# Altium project cameraFor4G.PrjPCB
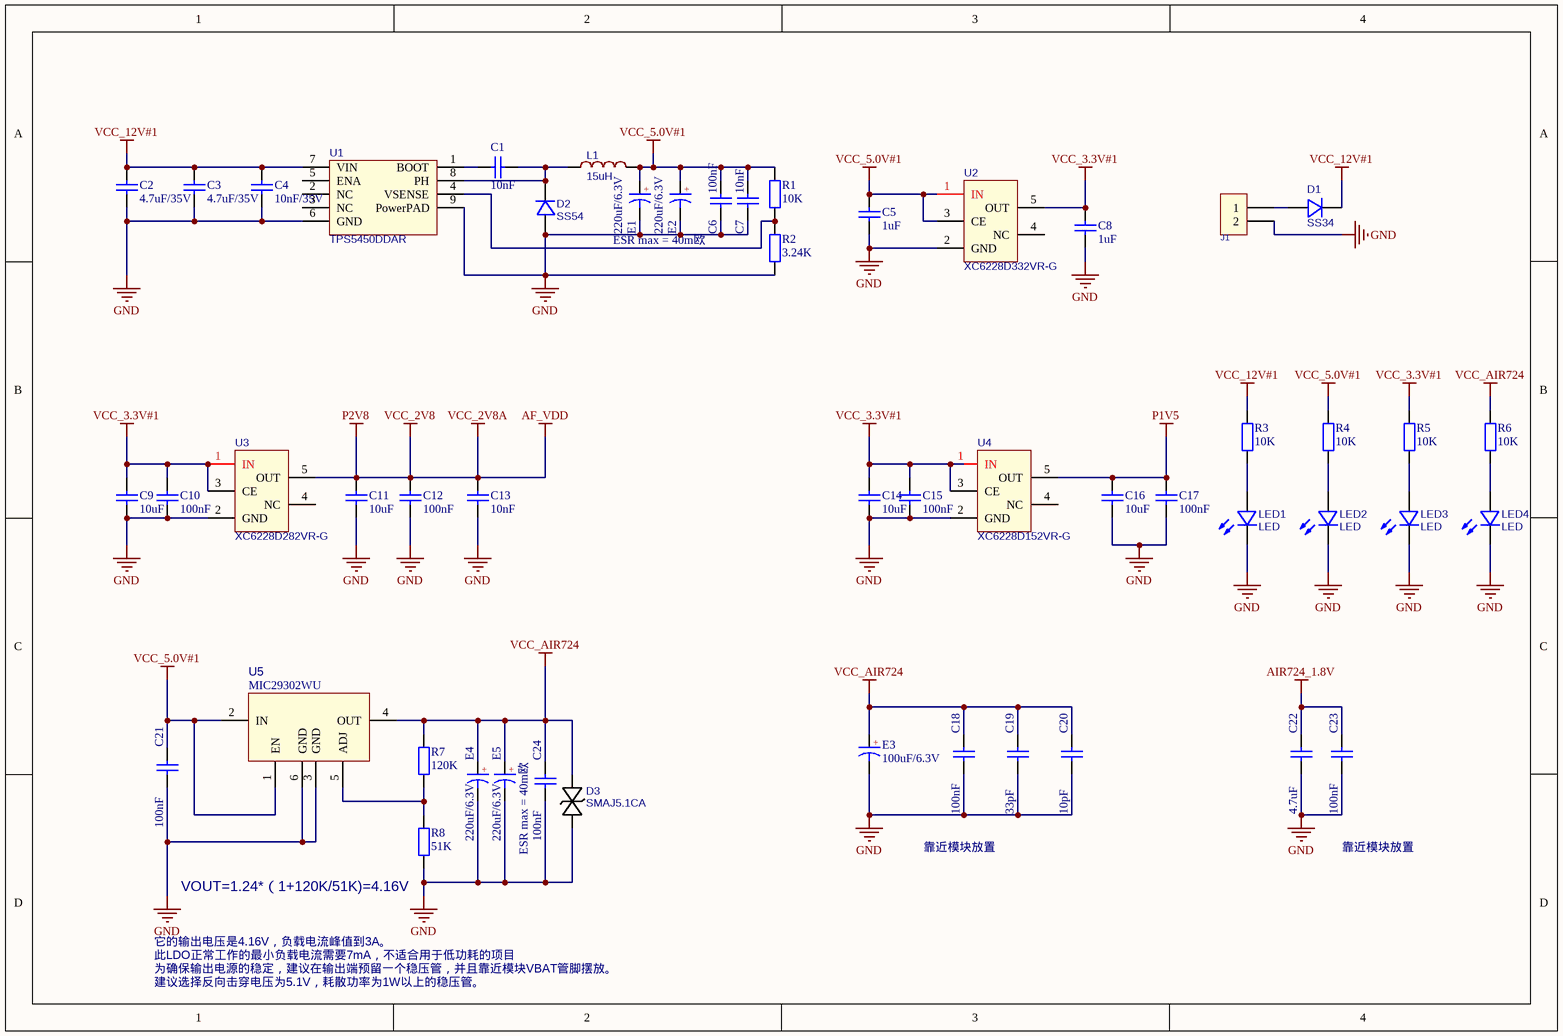
[diagram p0: 00_POWER.SchDoc]
4 sheets, 122 parts. Net scope: global (net labels, ports and power ports of the same name join across sheets).
Board file: cameraBoard.PcbDoc
Sheets:
  00_POWER.SchDoc
  01_MCU.SchDoc
  03_AIR724.SchDoc
  04_AIR724_PERIPHERAL.SchDoc

## Sheet 00_POWER.SchDoc
size A4

### Parts
C1  10nF  [0603-C]
C2  4.7uF/35V  [0805-C]
C3  4.7uF/35V  [0805-C]
C4  10nF/35V  [0603-C]
C5  1uF  [0603-C]
C6  100nF  [0603-C]
C7  10nF  [0603-C]
C8  1uF  [0603-C]
C9  10uF  [0603-C]
C10  100nF  [0603-C]
C11  10uF  [0603-C]
C12  100nF  [0603-C]
C13  10nF  [0603-C]
C14  10uF  [0603-C]
C15  100nF  [0603-C]
C16  10uF  [0603-C]
C17  100nF  [0603-C]
C18  100nF  [0603-C]
C19  33pF  [0603-C]
C20  10pF  [0603-C]
C21  100nF  [0603-C]
C22  4.7uF  [0603-C]
C23  100nF  [0603-C]
C24  100nF  [0603-C]
D1  SS34  [SS34-SMA]
D2  SS54  [SS34-SMA]
D3  SMAJ5.1CA  [ZENER]
E1  220uF/6.3V  [CD B(3528)]
E2  220uF/6.3V  [CD B(3528)]
E3  100uF/6.3V  [CD B(3528)]
E4  220uF/6.3V  [CD B(3528)]
E5  220uF/6.3V  [CD B(3528)]
J1  KF128-5.0-2P  [KF128-5.0-2P]  (value not drawn)
L1  15uH  [电感7*7*3]
LED1  LED  [LED-0603]
LED2  LED  [LED-0603]
LED3  LED  [LED-0603]
LED4  LED  [LED-0603]
R1  10K  [0603-R]
R2  3.24K  [0603-R]
R3  10K  [0603-R]
R4  10K  [0603-R]
R5  10K  [0603-R]
R6  10K  [0603-R]
R7  120K  [0603-R]
R8  51K  [0603-R]
U1  TPS5450DDAR  [TPS5430]
U2  XC6228D332VR-G  [XC6228D332VR-G]
U3  XC6228D282VR-G  [XC6228D332VR-G]
U4  XC6228D152VR-G  [XC6228D332VR-G]
U5  MIC29302WU  [MIC29302WU]

### Nets
AF_VDD: C11.2 C12.2 C13.2 U3.5(OUT)  [also labelled P2V8, VCC_2V8, VCC_2V8A]
AIR724_1.8V: C22.2 C23.2
GND: C2.2 C3.2 C4.1 C5.1 C6.2 C7.2 C8.1 C9.1 C10.1 C11.1 C12.1 C13.1 C14.1 C15.1 C16.1 C17.1 C18.1 C19.1 C20.1 C21.1 C22.1 C23.1 C24.1 D2.1(+) D3.2(A) E1.2(K) E2.2(K) E3.2(K) E4.2(K) E5.2(K) J1.2 LED1.1(-) LED2.1(-) LED3.1(-) LED4.1(-) R2.2 R8.2 U1.6(GND) U1.9(PowerPAD) U2.2(GND) U3.2(GND) U4.2(GND) U5.3(GND) U5.6(GND)
P1V5: C16.2 C17.2 U4.5(OUT)
VCC_3.3V#1: C8.2 C9.2 C10.2 C14.2 C15.2 R5.2 U2.5(OUT) U3.1(IN) U3.3(CE) U4.1(IN) U4.3(CE)
VCC_5.0V#1: C5.2 C6.1 C7.1 C21.2 E1.1(A) E2.1(A) L1.2 R1.1 R4.2 U2.1(IN) U2.3(CE) U5.1(EN) U5.2(IN)
VCC_12V#1: C2.1 C3.1 C4.2 D1.2(-) R3.2 U1.7(VIN)
VCC_AIR724: C18.2 C19.2 C20.2 C24.2 D3.1(C) E3.1(A) E4.1(A) E5.1(A) R6.2 R7.1 U5.4(OUT)
NetC1_1: C1.1 D2.2(-) L1.1 U1.8(PH)
NetC1_2: C1.2 U1.1(BOOT)
NetD1_1: D1.1(+) J1.1
NetLED1_2: LED1.2(+) R3.1
NetLED2_2: LED2.2(+) R4.1
NetLED3_2: LED3.2(+) R5.1
NetLED4_2: LED4.2(+) R6.1
NetR1_2: R1.2 R2.1 U1.4(VSENSE)
NetR7_2: R7.2 R8.1 U5.5(ADJ)

Not connected (* = marked no-connect by the designer): U1 2(NC) 3(NC) 5(ENA); U2 4(NC); U3 4(NC); U4 4(NC)

### Notes on the sheet
- ESR max = 40m欧
- 靠近模块放置
- (near R8) VOUT=1.24*（1+120K/51K)=4.16V
- 它的输出电压是4.16V，负载电流峰值到3A。
- 为确保输出电源的稳定，建议在输出端预留一个稳压管，并且靠近模块VBAT管脚摆放。
- 建议选择反向击穿电压为5.1V，耗散功率为1W以上的稳压管。
- 此LDO正常工作的最小负载电流需要7mA，不适合用于低功耗的项目
- (in symbol CT) +

### Library data of the parts
C1-C24 = C: 贴片电容; BOM名称: 无极性贴片电容; 联系卖家，免费查找封装: 唯一出售店铺网址https://shop463601444.taobao.com
D1 D2 = SS34: BOM_Manufacturer: Wuxi ARK Tech Elec; BOM_Manufacturer Part: D-G060306G1-KS2; Contributor: LCSC; BOM_Supplier: LCSC; BOM_Supplier Part: C118334; BOM_JLCPCB Part Class: Extended Part; spicePre: L; spiceSymbolName: D-G060306G1-KS2
D3 = SMAJ6.0CA: SMAJ6.0CA_C698928; BOM_Manufacturer: Yangzhou Yangjie Elec Tech; Contributor: LCSC; BOM_Supplier: LCSC; BOM_Supplier Part: C698928; BOM_Manufacturer Part: SMAJ6.0CA; BOM_JLCPCB Part Class: Extended Part; spicePre: D; spiceSymbolName: SMAJ6.0CA_C698928
E1-E5 = CT: 贴片钽电容; 联系卖家，免费查找封装: 唯一出售店铺网址https://shop463601444.taobao.com; BOM名称: 贴片钽电容
J1 = KF128-5.0-2P: Manufacturer: KEFA(科发); Add into BOM: yes; Pitch: 5mm; Structure: 1x2P; Number of PINs Per Row: 2; Current Rating (Max): 24A; Voltage Rating (Max): 250V; Wire Gauge - AWG: 12~22; Wire Gauge - mm2: 2.5; Name: KF128-5.0-2P; Symbol: KF128-5.0-2P; Device: KF128-5.0-2P; LCSC Part Name: 5mm 1x2P 排数:1 每排P数:2 直插 可拼接 铜 环保; Supplier Part: C474950; Manufacturer Part: KF128-5.0-2P; Supplier Footprint: 插件,P=5mm; JLCPCB Part Class: Extended Part; Datasheet: https://atta.szlcsc.com/upload/public/pdf/source/20230317/B8CD42C0E3A38C01CD877E6842427715.pdf; Supplier: LCSC; Convert to PCB: yes; Number of Rows: 1; Mounting Style: 直插; Operating Temperature Range: -40℃~+105℃; Color: 绿色; Number of Pins: 2P
L1 = L: BOM_Manufacturer: Sunlord; BOM_Manufacturer Part: UPZ2012D800-4R0TF; nameAlias: Value; Contributor: LCSC; BOM_Supplier: LCSC; BOM_Supplier Part: C145060; BOM_JLCPCB Part Class: Extended Part; spicePre: L; spiceSymbolName: UPZ2012D800-4R0TF
LED1-LED4 = LED: BOM_Manufacturer: Wuxi ARK Tech Elec; BOM_Manufacturer Part: D-G060306G1-KS2; Contributor: LCSC; BOM_Supplier: LCSC; BOM_Supplier Part: C118334; BOM_JLCPCB Part Class: Extended Part; spicePre: L; spiceSymbolName: D-G060306G1-KS2
R1-R8 = R: 贴片电阻; 联系卖家，免费查找封装: 唯一出售店铺网址https://shop463601444.taobao.com; BOM名称: 贴片电阻
U1 = TPS5430DDAR: BOM_Manufacturer: TI; BOM_Supplier: LCSC; BOM_Manufacturer Part: TPS5430DDAR; BOM_Supplier Part: C9864; BOM_JLCPCB Part Class: Basic Part; spicePre: U; spiceSymbolName: TPS5430DDAR
U2 = XC6228D332VR-G: 输出类型：固定 输出极性：正 输出通道数：1 最大输入电压：5.5V 输出电压：3.3V 压差：305mV@(300mA) 输出电流：300mA 电源纹波抑制比(PSRR)：80dB@(1kHz) 3.3V固定输出，Iout=300mA，Vin=5.5V(Max); BOM_Manufacturer: TOREX; BOM_Supplier: LCSC; BOM_Manufacturer Part: XC6228D332VR-G; BOM_Supplier Part: C69841; BOM_JLCPCB Part Class: Extended Part; spicePre: U; spiceSymbolName: XC6228D332VR-G
U3 U4 = XC6228D282VR-G: 输出类型：固定 输出极性：正 输出通道数：1 最大输入电压：5.5V 输出电压：2.8V 压差：305mV@(300mA) 输出电流：300mA 电源纹波抑制比(PSRR)：80dB@(1kHz) 3.3V固定输出，Iout=300mA，Vin=5.5V(Max); BOM_Manufacturer: TOREX; BOM_Supplier: LCSC; BOM_Manufacturer Part: XC6228D332VR-G; BOM_Supplier Part: C69841; BOM_JLCPCB Part Class: Extended Part; spicePre: U; spiceSymbolName: XC6228D332VR-G
U5 = MIC29302WU: Manufacturer: UMW(友台半导体); Symbol: MIC29302WU_C2995533; Add into BOM: yes; Name: MIC29302WU; Device: MIC29302WU; LCSC Part Name: 3A Fast-Response LDO Regulator; Supplier Part: C2995533; Manufacturer Part: MIC29302WU; Supplier Footprint: TO-263; JLCPCB Part Class: Extended Part; Datasheet: https://atta.szlcsc.com/upload/public/pdf/source/20220414/64A379364ACD2069C59BD188E91B8798.pdf; Supplier: LCSC; Convert to PCB: yes

## Sheet 01_MCU.SchDoc
size A3
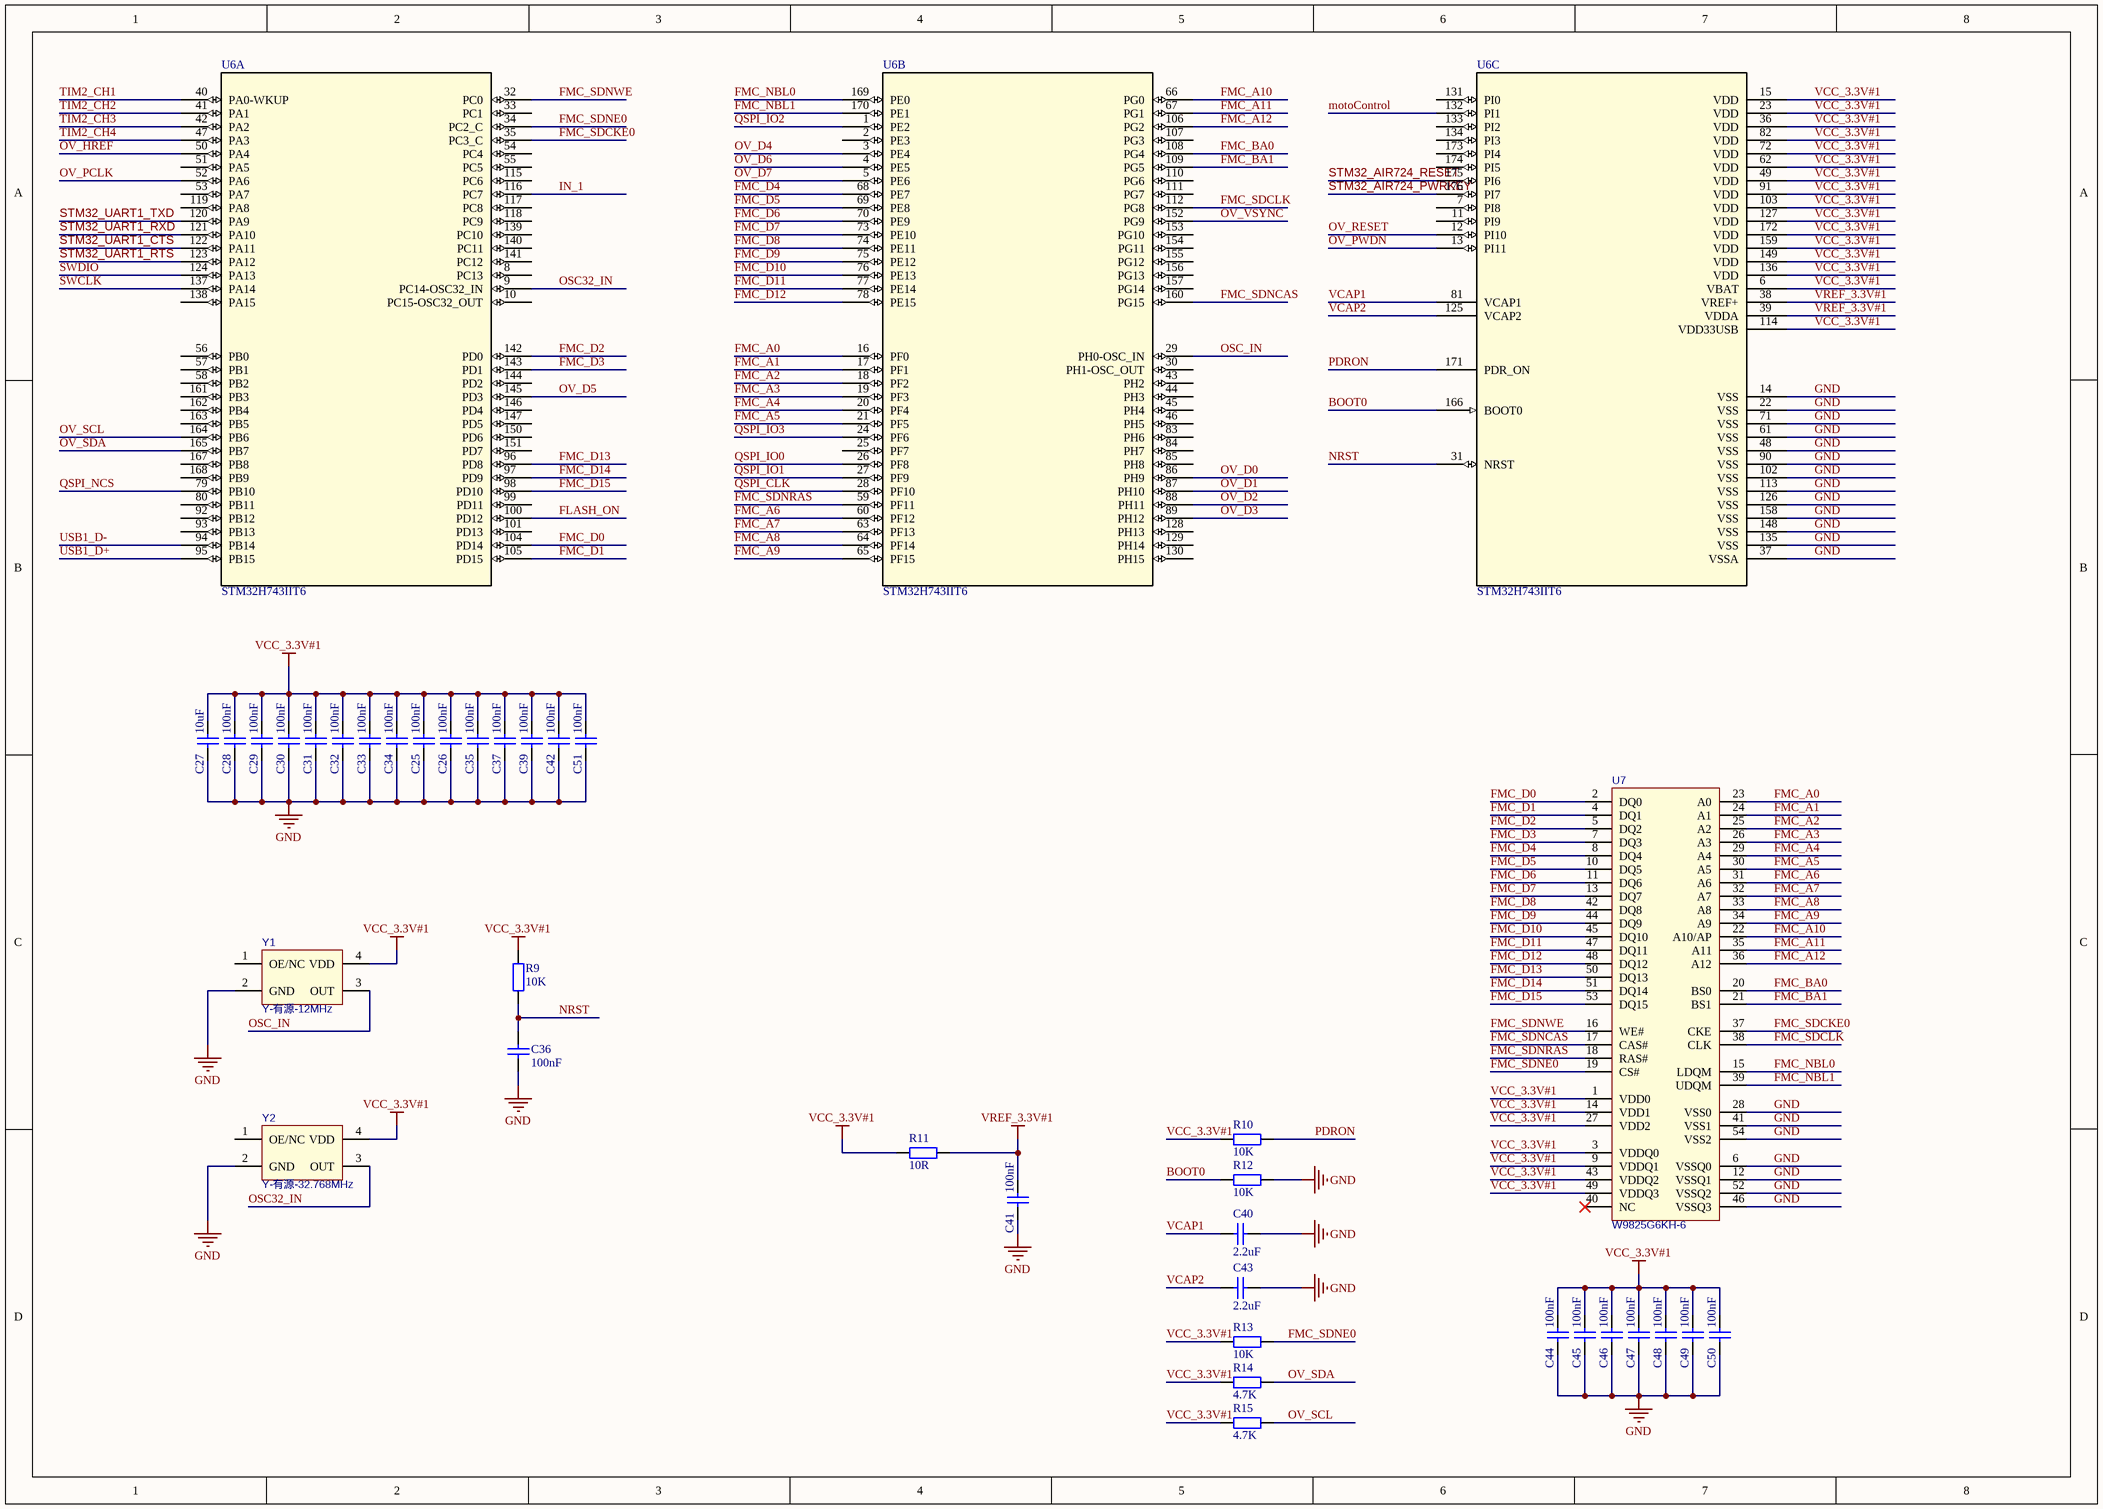
[diagram p1: 01_MCU.SchDoc]

### Parts
C25  100nF  [0603-C]
C26  100nF  [0603-C]
C27  10uF  [0603-C]
C28  100nF  [0603-C]
C29  100nF  [0603-C]
C30  100nF  [0603-C]
C31  100nF  [0603-C]
C32  100nF  [0603-C]
C33  100nF  [0603-C]
C34  100nF  [0603-C]
C35  100nF  [0603-C]
C36  100nF  [0603-C]
C37  100nF  [0603-C]
C39  100nF  [0603-C]
C40  2.2uF  [0603-C]
C41  100nF  [0603-C]
C42  100nF  [0603-C]
C43  2.2uF  [0603-C]
C44  100nF  [0603-C]
C45  100nF  [0603-C]
C46  100nF  [0603-C]
C47  100nF  [0603-C]
C48  100nF  [0603-C]
C49  100nF  [0603-C]
C50  100nF  [0603-C]
C51  100nF  [0603-C]
R9  10K  [0603-R]
R10  10K  [0603-R]
R11  10R  [0603-R]
R12  10K  [0603-R]
R13  10K  [0603-R]
R14  4.7K  [0603-R]
R15  4.7K  [0603-R]
U6  STM32H743IIT6  [LQFP176-24x24mm]  (parts A,B,C of 3)
U7  W9825G6KH-6  [W9825G6KH-6]
Y1  Y-有源-12MHz  [3225]
Y2  Y-有源-32.768MHz  [3225]

### Nets
GND: C25.1 C26.1 C27.1 C28.1 C29.1 C30.1 C31.1 C32.1 C33.1 C34.1 C35.1 C36.1 C37.1 C39.1 C40.2 C41.1 C42.1 C43.2 C44.1 C45.1 C46.1 C47.1 C48.1 C49.1 C50.1 C51.1 R12.1 U6.14(VSS) U6.22(VSS) U6.37(VSSA) U6.48(VSS) U6.61(VSS) U6.71(VSS) U6.90(VSS) U6.102(VSS) U6.113(VSS) U6.126(VSS) U6.135(VSS) U6.148(VSS) U6.158(VSS) U7.6(VSSQ0) U7.12(VSSQ1) U7.28(VSS0) U7.41(VSS1) U7.46(VSSQ3) U7.52(VSSQ2) U7.54(VSS2) Y1.2(GND) Y2.2(GND)
VCC_3.3V#1: C25.2 C26.2 C27.2 C28.2 C29.2 C30.2 C31.2 C32.2 C33.2 C34.2 C35.2 C37.2 C39.2 C42.2 C44.2 C45.2 C46.2 C47.2 C48.2 C49.2 C50.2 C51.2 R9.2 R10.2 R11.2 R13.2 R14.2 R15.2 U6.6(VBAT) U6.15(VDD) U6.23(VDD) U6.36(VDD) U6.49(VDD) U6.62(VDD) U6.72(VDD) U6.82(VDD) U6.91(VDD) U6.103(VDD) U6.114(VDD33USB) U6.127(VDD) U6.136(VDD) U6.149(VDD) U6.159(VDD) U6.172(VDD) U7.1(VDD0) U7.3(VDDQ0) U7.9(VDDQ1) U7.14(VDD1) U7.27(VDD2) U7.43(VDDQ2) U7.49(VDDQ3) Y1.4(VDD) Y2.4(VDD)
VREF_3.3V#1: C41.2 R11.1 U6.38(VREF+) U6.39(VDDA)
BOOT0: R12.2 U6.166(BOOT0)
FLASH_ON: U6.100(PD12)
FMC_A0: U6.16(PF0) U7.23(A0)
FMC_A1: U6.17(PF1) U7.24(A1)
FMC_A2: U6.18(PF2) U7.25(A2)
FMC_A3: U6.19(PF3) U7.26(A3)
FMC_A4: U6.20(PF4) U7.29(A4)
FMC_A5: U6.21(PF5) U7.30(A5)
FMC_A6: U6.60(PF12) U7.31(A6)
FMC_A7: U6.63(PF13) U7.32(A7)
FMC_A8: U6.64(PF14) U7.33(A8)
FMC_A9: U6.65(PF15) U7.34(A9)
FMC_A10: U6.66(PG0) U7.22(A10/AP)
FMC_A11: U6.67(PG1) U7.35(A11)
FMC_A12: U6.106(PG2) U7.36(A12)
FMC_BA0: U6.108(PG4) U7.20(BS0)
FMC_BA1: U6.109(PG5) U7.21(BS1)
FMC_D0: U6.104(PD14) U7.2(DQ0)
FMC_D1: U6.105(PD15) U7.4(DQ1)
FMC_D2: U6.142(PD0) U7.5(DQ2)
FMC_D3: U6.143(PD1) U7.7(DQ3)
FMC_D4: U6.68(PE7) U7.8(DQ4)
FMC_D5: U6.69(PE8) U7.10(DQ5)
FMC_D6: U6.70(PE9) U7.11(DQ6)
FMC_D7: U6.73(PE10) U7.13(DQ7)
FMC_D8: U6.74(PE11) U7.42(DQ8)
FMC_D9: U6.75(PE12) U7.44(DQ9)
FMC_D10: U6.76(PE13) U7.45(DQ10)
FMC_D11: U6.77(PE14) U7.47(DQ11)
FMC_D12: U6.78(PE15) U7.48(DQ12)
FMC_D13: U6.96(PD8) U7.50(DQ13)
FMC_D14: U6.97(PD9) U7.51(DQ14)
FMC_D15: U6.98(PD10) U7.53(DQ15)
FMC_NBL0: U6.169(PE0) U7.15(LDQM)
FMC_NBL1: U6.170(PE1) U7.39(UDQM)
FMC_SDCKE0: U6.35(PC3_C) U7.37(CKE)
FMC_SDCLK: U6.112(PG8) U7.38(CLK)
FMC_SDNCAS: U6.160(PG15) U7.17(CAS#)
FMC_SDNE0: R13.1 U6.34(PC2_C) U7.19(CS#)
FMC_SDNRAS: U6.59(PF11) U7.18(RAS#)
FMC_SDNWE: U6.32(PC0) U7.16(WE#)
IN_1: U6.116(PC7)
motoControl: U6.132(PI1)
NRST: C36.2 R9.1 U6.31(NRST)
OSC32_IN: U6.9(PC14-OSC32_IN) Y2.3(OUT)
OSC_IN: U6.29(PH0-OSC_IN) Y1.3(OUT)
OV_D0: U6.86(PH9)
OV_D1: U6.87(PH10)
OV_D2: U6.88(PH11)
OV_D3: U6.89(PH12)
OV_D4: U6.3(PE4)
OV_D5: U6.145(PD3)
OV_D6: U6.4(PE5)
OV_D7: U6.5(PE6)
OV_HREF: U6.50(PA4)
OV_PCLK: U6.52(PA6)
OV_PWDN: U6.13(PI11)
OV_RESET: U6.12(PI10)
OV_SCL: R15.1 U6.164(PB6)
OV_SDA: R14.1 U6.165(PB7)
OV_VSYNC: U6.152(PG9)
PDRON: R10.1 U6.171(PDR_ON)
QSPI_CLK: U6.28(PF10)
QSPI_IO0: U6.26(PF8)
QSPI_IO1: U6.27(PF9)
QSPI_IO2: U6.1(PE2)
QSPI_IO3: U6.24(PF6)
QSPI_NCS: U6.79(PB10)
STM32_AIR724_PWRKEY: U6.176(PI7)
STM32_AIR724_RESET: U6.175(PI6)
STM32_UART1_CTS: U6.122(PA11)
STM32_UART1_RTS: U6.123(PA12)
STM32_UART1_RXD: U6.121(PA10)
STM32_UART1_TXD: U6.120(PA9)
SWCLK: U6.137(PA14)
SWDIO: U6.124(PA13)
TIM2_CH1: U6.40(PA0-WKUP)
TIM2_CH2: U6.41(PA1)
TIM2_CH3: U6.42(PA2)
TIM2_CH4: U6.47(PA3)
USB1_D+: U6.95(PB15)
USB1_D-: U6.94(PB14)
VCAP1: C40.1 U6.81(VCAP1)
VCAP2: C43.1 U6.125(VCAP2)

Not connected (* = marked no-connect by the designer): U6 2(PE3) 7(PI8) 8(PC13) 10(PC15-OSC32_OUT) 11(PI9) 25(PF7) 30(PH1-OSC_OUT) 33(PC1) 43(PH2) 44(PH3) 45(PH4) 46(PH5) 51(PA5) 53(PA7) 54(PC4) 55(PC5) 56(PB0) 57(PB1) 58(PB2) 80(PB11) 83(PH6) 84(PH7) 85(PH8) 92(PB12) 93(PB13) 99(PD11) 101(PD13) 107(PG3) 110(PG6) 111(PG7) 115(PC6) 117(PC8) 118(PC9) 119(PA8) 128(PH13) 129(PH14) 130(PH15) 131(PI0) 133(PI2) 134(PI3) 138(PA15) 139(PC10) 140(PC11) 141(PC12) 144(PD2) 146(PD4) 147(PD5) 150(PD6) 151(PD7) 153(PG10) 154(PG11) 155(PG12) 156(PG13) 157(PG14) 161(PB3) 162(PB4) 163(PB5) 167(PB8) 168(PB9) 173(PI4) 174(PI5); U7 40(NC)*; Y1 1(OE/NC); Y2 1(OE/NC)

### Library data of the parts
C25-C37 C39-C51 = C: as C1 on sheet 00_POWER
R9-R15 = R: as R1 on sheet 00_POWER; BOM名称: 贴片电阻
U6 = STM32H743IIT6: No Description Available; Mfr_Name: STMicroelectronics; Copyright: Copyright (C) 2023 Ultra Librarian. All rights reserved.; Manufacturer_Part_Number: STM32H743IIT6; RefDes: RefDes; Type: DEV
U7 = W9825G6KH-6: BOM_Manufacturer: WINBOND; BOM_Supplier: LCSC; BOM_Manufacturer Part: W9825G6KH-6; BOM_Supplier Part: C62246; BOM_JLCPCB Part Class: Extended Part; spicePre: U; spiceSymbolName: W9825G6KH-6
Y1 Y2 = Y-有源: 有源晶振; BOM_Manufacturer: YXC扬兴科技; BOM_Manufacturer Part: OT322540MJBA4SL; nameAlias: Frequency; Contributor: LCSC; BOM_Supplier: LCSC; BOM_Supplier Part: C2831396; BOM_JLCPCB Part Class: Extended Part; spicePre: X; spiceSymbolName: OT322540MJBA4SL

## Sheet 03_AIR724.SchDoc
size A4
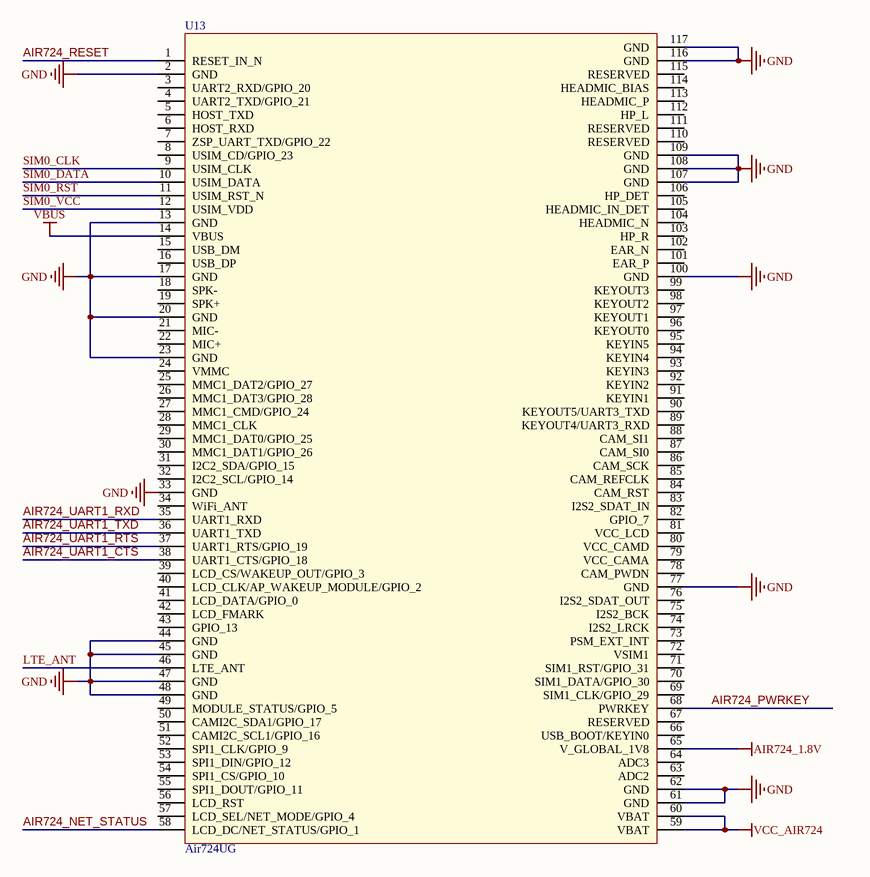
[diagram p2: 03_AIR724.SchDoc]

### Parts
U13  Air724UG  [AIR724UG]

### Nets
AIR724_1.8V: U13.65(V_GLOBAL_1V8)
GND: U13.2(GND) U13.13(GND) U13.17(GND) U13.20(GND) U13.23(GND) U13.33(GND) U13.44(GND) U13.45(GND) U13.47(GND) U13.48(GND) U13.61(GND) U13.62(GND) U13.77(GND) U13.100(GND) U13.107(GND) U13.108(GND) U13.109(GND) U13.116(GND) U13.117(GND)
VBUS: U13.14(VBUS)
VCC_AIR724: U13.59(VBAT) U13.60(VBAT)
AIR724_NET_STATUS: U13.58(LCD_DC/NET_STATUS/GPIO_1)
AIR724_PWRKEY: U13.68(PWRKEY)
AIR724_RESET: U13.1(RESET_IN_N)
AIR724_UART1_CTS: U13.38(UART1_CTS/GPIO_18)
AIR724_UART1_RTS: U13.37(UART1_RTS/GPIO_19)
AIR724_UART1_RXD: U13.35(UART1_RXD)
AIR724_UART1_TXD: U13.36(UART1_TXD)
LTE_ANT: U13.46(LTE_ANT)
SIM0_CLK: U13.9(USIM_CLK)
SIM0_DATA: U13.10(USIM_DATA)
SIM0_RST: U13.11(USIM_RST_N)
SIM0_VCC: U13.12(USIM_VDD)

Not connected (* = marked no-connect by the designer): U13 3(UART2_RXD/GPIO_20) 4(UART2_TXD/GPIO_21) 5(HOST_TXD) 6(HOST_RXD) 7(ZSP_UART_TXD/GPIO_22) 8(USIM_CD/GPIO_23) 15(USB_DM) 16(USB_DP) 18(SPK-) 19(SPK+) 21(MIC-) 22(MIC+) 24(VMMC) 25(MMC1_DAT2/GPIO_27) 26(MMC1_DAT3/GPIO_28) 27(MMC1_CMD/GPIO_24) 28(MMC1_CLK) 29(MMC1_DAT0/GPIO_25) 30(MMC1_DAT1/GPIO_26) 31(I2C2_SDA/GPIO_15) 32(I2C2_SCL/GPIO_14) 34(WiFi_ANT) 39(LCD_CS/WAKEUP_OUT/GPIO_3) 40(LCD_CLK/AP_WAKEUP_MODULE/GPIO_2) 41(LCD_DATA/GPIO_0) 42(LCD_FMARK) 43(GPIO_13) 49(MODULE_STATUS/GPIO_5) 50(CAMI2C_SDA1/GPIO_17) 51(CAMI2C_SCL1/GPIO_16) 52(SPI1_CLK/GPIO_9) 53(SPI1_DIN/GPIO_12) 54(SPI1_CS/GPIO_10) 55(SPI1_DOUT/GPIO_11) 56(LCD_RST) 57(LCD_SEL/NET_MODE/GPIO_4) 63(ADC2) 64(ADC3) 66(USB_BOOT/KEYIN0) 67(RESERVED) 69(SIM1_CLK/GPIO_29) 70(SIM1_DATA/GPIO_30) 71(SIM1_RST/GPIO_31) 72(VSIM1) 73(PSM_EXT_INT) 74(I2S2_LRCK) 75(I2S2_BCK) 76(I2S2_SDAT_OUT) 78(CAM_PWDN) 79(VCC_CAMA) 80(VCC_CAMD) 81(VCC_LCD) 82(GPIO_7) 83(I2S2_SDAT_IN) 84(CAM_RST) 85(CAM_REFCLK) 86(CAM_SCK) 87(CAM_SI0) 88(CAM_SI1) 89(KEYOUT4/UART3_RXD) 90(KEYOUT5/UART3_TXD) 91(KEYIN1) 92(KEYIN2) 93(KEYIN3) 94(KEYIN4) 95(KEYIN5) 96(KEYOUT0) 97(KEYOUT1) 98(KEYOUT2) 99(KEYOUT3) 101(EAR_P) 102(EAR_N) 103(HP_R) 104(HEADMIC_N) 105(HEADMIC_IN_DET) 106(HP_DET) 110(RESERVED) 111(RESERVED) 112(HP_L) 113(HEADMIC_P) 114(HEADMIC_BIAS) 115(RESERVED)

### Library data of the parts
U13 = Air724UG: Manufacturer: Luat(合宙); Symbol: AIR724UG-NA; Add into BOM: yes; Device: Air724UG-NA; LCSC Part Name: 合宙Luat 4G Cat.1模组Air724UG; Supplier Part: C559028; Manufacturer Part: Air724UG-NA; Supplier Footprint: SMD; JLCPCB Part Class: 扩展库; Supplier: LCSC; Convert to PCB: yes

## Sheet 04_AIR724_PERIPHERAL.SchDoc
size A4
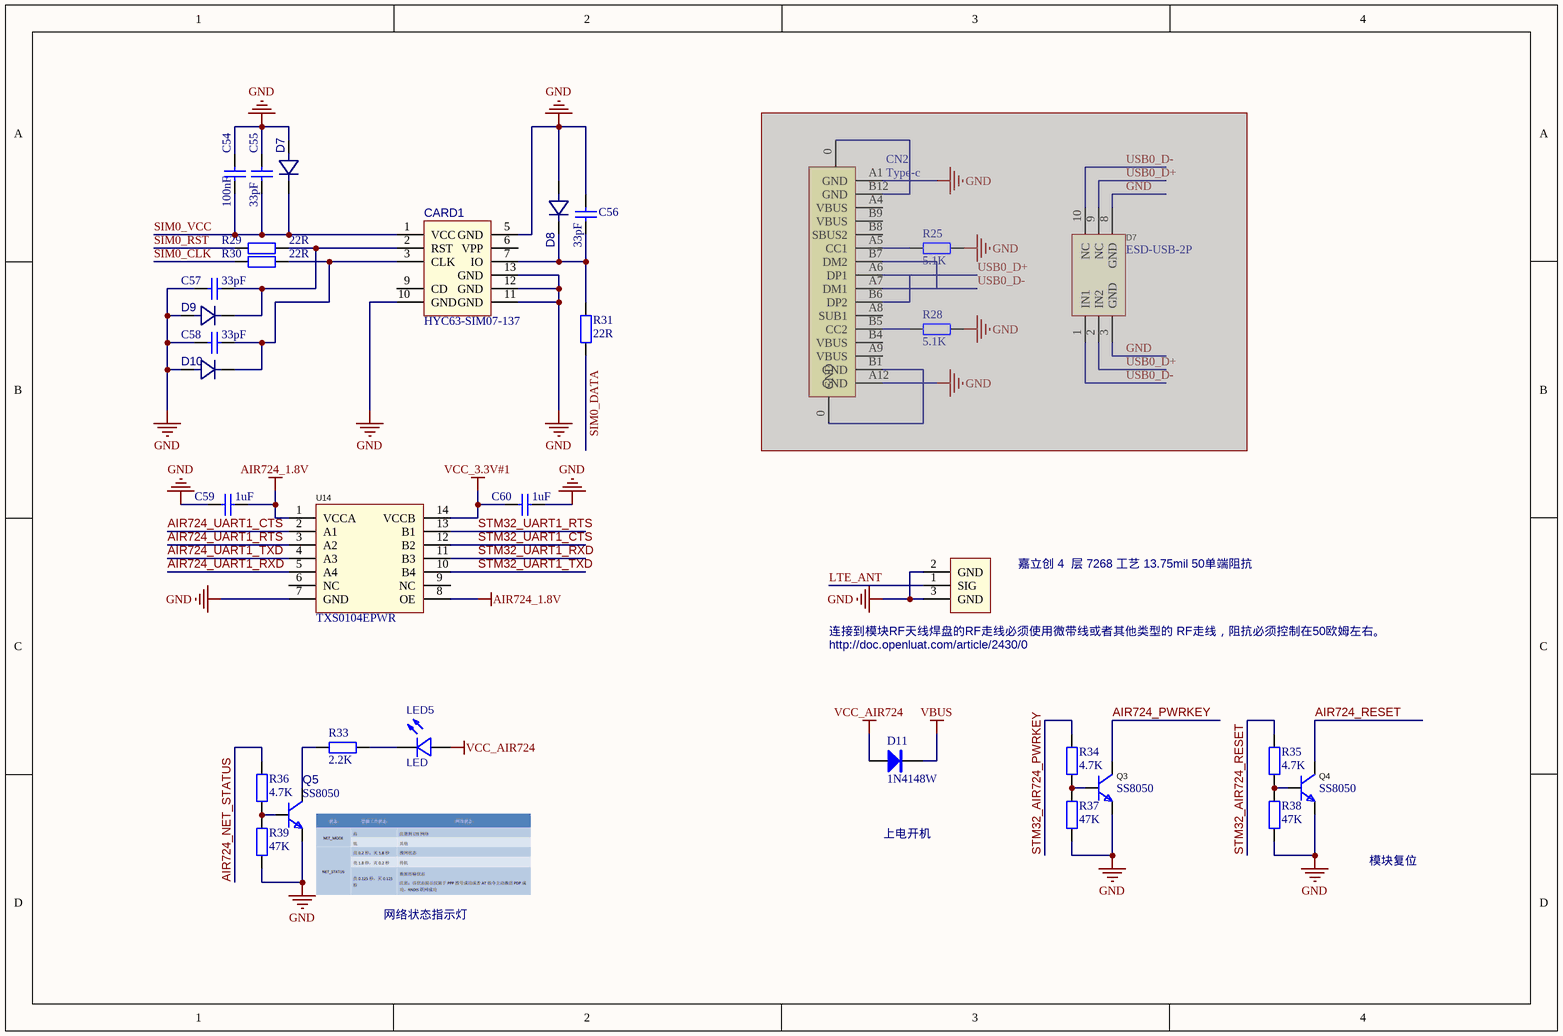
[diagram p3: 04_AIR724_PERIPHERAL.SchDoc]

### Parts
(Parts that share a designator on the sheet are numbered #1, #2 ... from top to bottom, then left to right.)
C54  100nF  [0603-C]
C55  33pF  [0603-C]
C56  33pF  [0603-C]
C57  33pF  [0603-C]
C58  33pF  [0603-C]
C59  1uF  [0603-C]
C60  1uF  [0603-C]
CARD1  HYC63-SIM07-137  [NANO-SIM-SMD_HYC63-SIM07-137]
CN2  Type-c  [Type-c 16pin]  (masked out: inside a compile mask, not in the netlist)
D7#1  ESD9X5.0ST5G  [ESD9X5.0ST5G]  (value not drawn)
D7#2  ESD-USB-2P  [SLP2510P8-2P]  (masked out: inside a compile mask, not in the netlist)
D8  ESD9X5.0ST5G  [ESD9X5.0ST5G]  (value not drawn)
D9  ESD9X5.0ST5G  [ESD9X5.0ST5G]  (value not drawn)
D10  ESD9X5.0ST5G  [ESD9X5.0ST5G]  (value not drawn)
D11  1N4148W  [1N4148W]
LED5  LED  [LED-0603]
Q3  SS8050  [SOT23-3M]
Q4  SS8050  [SOT23-3M]
Q5  SS8050  [SOT23-3M]
R25  5.1K  [0603-R]  (masked out: inside a compile mask, not in the netlist)
R28  5.1K  [0603-R]  (masked out: inside a compile mask, not in the netlist)
R29  22R  [0603-R]
R30  22R  [0603-R]
R31  22R  [0603-R]
R33  2.2K  [0603-R]
R34  4.7K  [0603-R]
R35  4.7K  [0603-R]
R36  4.7K  [0603-R]
R37  47K  [0603-R]
R38  47K  [0603-R]
R39  47K  [0603-R]
RF1  IPEX  [IPEX-SMD-1代]  (value not drawn)
U14  TXS0104EPWR  [TXS0104EPWR]

### Nets
AIR724_1.8V: C59.1 U14.1(VCCA) U14.8(OE)
GND: C54.2 C55.2 C56.2 C57.2 C58.2 C59.2 C60.1 CARD1.5(GND) CARD1.10(GND) CARD1.11(GND) CARD1.12(GND) CARD1.13(GND) D7#1.2(A) D8.2(A) D9.2(A) D10.2(A) Q3.2(E) Q4.2(E) Q5.2(E) R37.1 R38.1 R39.1 RF1.2(GND) RF1.3(GND) U14.7(GND)
VBUS: D11.2(K)
VCC_3.3V#1: C60.2 U14.14(VCCB)
VCC_AIR724: D11.1(A) LED5.2(+)
AIR724_NET_STATUS: R36.2
AIR724_PWRKEY: Q3.3(C)
AIR724_RESET: Q4.3(C)
AIR724_UART1_CTS: U14.2(A1)
AIR724_UART1_RTS: U14.3(A2)
AIR724_UART1_RXD: U14.5(A4)
AIR724_UART1_TXD: U14.4(A3)
LTE_ANT: RF1.1(SIG)
SIM0_CLK: R30.1
SIM0_DATA: R31.1
SIM0_RST: R29.1
SIM0_VCC: C54.1 C55.1 CARD1.1(VCC) D7#1.1(K)
STM32_AIR724_PWRKEY: R34.2
STM32_AIR724_RESET: R35.2
STM32_UART1_CTS: U14.12(B2)
STM32_UART1_RTS: U14.13(B1)
STM32_UART1_RXD: U14.11(B3)
STM32_UART1_TXD: U14.10(B4)
NetC56_1: C56.1 CARD1.7(IO) D8.1(K) R31.2
NetC57_1: C57.1 CARD1.2(RST) D9.1(K) R29.2
NetC58_1: C58.1 CARD1.3(CLK) D10.1(K) R30.2
NetLED5_1: LED5.1(-) R33.1
NetQ3_1: Q3.1(B) R34.1 R37.2
NetQ4_1: Q4.1(B) R35.1 R38.2
NetQ5_1: Q5.1(B) R36.1 R39.2
NetQ5_3: Q5.3(C) R33.2

Not connected (* = marked no-connect by the designer): CARD1 6(VPP) 9(CD); U14 6(NC) 9(NC)

### Notes on the sheet
- 嘉立创 4  层 7268 工艺 13.75mil 50单端阻抗
- (near RF1) 连接到模块RF天线焊盘的RF走线必须使用微带线或者其他类型的 RF走线，阻抗必须控制在50欧姆左右。
- (near RF1) http://doc.openluat.com/article/2430/0
- 上电开机
- 网络状态指示灯
- 模块复位

### Library data of the parts
C54-C60 = C: as C1 on sheet 00_POWER
CARD1 = NanoSIM卡座: 自弹式 NanoSIM卡 卡座 带CD PIN 带柱; Manufacturer: 华宇创; Add into BOM: yes; Body Height (Max): 1.25mm; Name: HYC63-SIM07-137; Symbol: HYC63-SIM07-137; Device: HYC63-SIM07-137; LCSC Part Name: 自弹式 NanoSIM卡 卡座 带CD PIN 带柱; Supplier Part: C645507; Manufacturer Part: HYC63-SIM07-137; Supplier Footprint: SMD; JLCPCB Part Class: Extended Part; Datasheet: https://atta.szlcsc.com/upload/public/pdf/source/20200616/C645507_89E3671A4105357B007331596DCB72F5.pdf; Supplier: LCSC; Convert to PCB: yes; Card Connection Mode: 自弹式; Card Type: NanoSIM卡; Connector Type: 卡座; Contact Material: -; Contact Plating: -; Operating Temperature Range: -20℃~+60℃
CN2 = Type-c: U262-161N-4BVC11
D7#1 D8-D10 = ESD9X5.0ST5G: Manufacturer: MSKSEMI(美森科); Symbol: ESD9X5.0ST5G_C3008066; Add into BOM: yes; Name: ESD9X5.0ST5G; Device: ESD9X5.0ST5G_C3008066; LCSC Part Name: ESD9X5.0ST5G; Supplier Part: C3008066; Manufacturer Part: ESD9X5.0ST5G; Supplier Footprint: SOD-923; JLCPCB Part Class: Extended Part; Datasheet: https://atta.szlcsc.com/upload/public/pdf/source/20220429/68E9B40153609821FAF30C4C48AA4713.pdf; Supplier: LCSC; Convert to PCB: yes
D7#2 = ESD-USB-2P: RClamp0522PATCT; Manufacturer: SEMTECH; Name: RClamp0524PATCT; Device: RClamp0524PATCT_C40960; Add into BOM: yes; Reverse Stand-Off Voltage (Vrwm): 5V; Breakdown Voltage (VBR): 6V; Clamping Voltage@Ipp: 15V; Peak Pulse Power(Ppp)@8/20us: 150W; Junction Capacitance(Cj)@1MHz: 0.8pF@1MHz; Symbol: RClamp0524PATCT; LCSC Part Name: RClamp0524PATCT; Supplier Part: C40960; Manufacturer Part: RClamp0524PATCT; Supplier Footprint: SLP2510P8; JLCPCB Part Class: Extended Part; Datasheet: https://atta.szlcsc.com/upload/public/pdf/source/20150124/1457707260739.pdf; Supplier: LCSC; Convert to PCB: yes; Operating Temperature: -55℃~+125℃@(Tj)
D11 = 1N4148W: 整流二极管; 版权归属: 源创客; BOM名称: 整流二极管; 学习资源: www.ooocke.com
LED5 = LED: as LED1 on sheet 00_POWER; BOM_Supplier: LCSC; BOM_Supplier Part: C118334; BOM_JLCPCB Part Class: Extended Part; spicePre: L; spiceSymbolName: D-G060306G1-KS2
R25 R28-R31 R33-R39 = R: as R1 on sheet 00_POWER; BOM名称: 贴片电阻
RF1 = IPEX: Manufacturer: BAT WIRELESS(蝙蝠无线); Name: BWIPX-1-001E; Add into BOM: yes; Connector Type: 板端; Interface Type: 内针; Frequency-Max: 6GHz; Number of Ports: 1; Impedance: 50Ω; Symbol: BWIPX-1-001E; Device: BWIPX-1-001E; LCSC Part Name: IPEX 内针 IPEX内针 天线座 IPEX-1 IPEX1 1代; Supplier Part: C496552; Manufacturer Part: BWIPX-1-001E; Supplier Footprint: SMD; JLCPCB Part Class: Extended Part; Datasheet: https://atta.szlcsc.com/upload/public/pdf/source/20201223/C496552_05E5A9956EAE1A8819C5051D085B1DED.pdf; Supplier: LCSC; Convert to PCB: yes; Interface Diameter: -; RF Series: IPEX; Style: -; Interface Length/Height: -; Operating Temperature Range: -
U14 = TXS0104EPWR: Manufacturer: TI(德州仪器); Add into BOM: yes; Channel Type: 双向; Number of Circuits: 1; Channels per Circuit: 4; Supply Voltage (VCCA): 1.65V~3.6V; Supply Voltage (VCCB): 2.3V~5.5V; Output Type: 推挽式；开路漏极; Data Rate: 24Mbps; Name: TXS0104EPWR; Symbol: TXS0104EPWR; Device: TXS0104EPWR; LCSC Part Name: TXS0104EPWR; Supplier Part: C44955; Manufacturer Part: TXS0104EPWR; Supplier Footprint: TSSOP-14; JLCPCB Part Class: Extended Part; Datasheet: https://www.ti.com/cn/lit/gpn/txs0104e; Supplier: LCSC; Convert to PCB: yes; Operating Temperature: -40℃~+85℃; Features: 自动方向检测

## Nets that join several sheets
AIR724_1.8V: 00_POWER (C22.2 C23.2), 03_AIR724 (U13.65), 04_AIR724_PERIPHERAL (C59.1 U14.1 U14.8)
GND: 00_POWER (44 pins), 01_MCU (49 pins), 03_AIR724 (19 pins), 04_AIR724_PERIPHERAL (25 pins)
VBUS: 03_AIR724 (U13.14), 04_AIR724_PERIPHERAL (D11.2)
VCC_3.3V#1: 00_POWER (11 pins), 01_MCU (53 pins), 04_AIR724_PERIPHERAL (C60.2 U14.14)
VCC_AIR724: 00_POWER (11 pins), 03_AIR724 (U13.59 U13.60), 04_AIR724_PERIPHERAL (D11.1 LED5.2)
AIR724_NET_STATUS: 03_AIR724 (U13.58), 04_AIR724_PERIPHERAL (R36.2)
AIR724_PWRKEY: 03_AIR724 (U13.68), 04_AIR724_PERIPHERAL (Q3.3)
AIR724_RESET: 03_AIR724 (U13.1), 04_AIR724_PERIPHERAL (Q4.3)
AIR724_UART1_CTS: 03_AIR724 (U13.38), 04_AIR724_PERIPHERAL (U14.2)
AIR724_UART1_RTS: 03_AIR724 (U13.37), 04_AIR724_PERIPHERAL (U14.3)
AIR724_UART1_RXD: 03_AIR724 (U13.35), 04_AIR724_PERIPHERAL (U14.5)
AIR724_UART1_TXD: 03_AIR724 (U13.36), 04_AIR724_PERIPHERAL (U14.4)
LTE_ANT: 03_AIR724 (U13.46), 04_AIR724_PERIPHERAL (RF1.1)
SIM0_CLK: 03_AIR724 (U13.9), 04_AIR724_PERIPHERAL (R30.1)
SIM0_DATA: 03_AIR724 (U13.10), 04_AIR724_PERIPHERAL (R31.1)
SIM0_RST: 03_AIR724 (U13.11), 04_AIR724_PERIPHERAL (R29.1)
SIM0_VCC: 03_AIR724 (U13.12), 04_AIR724_PERIPHERAL (C54.1 C55.1 CARD1.1 D7#1.1)
STM32_AIR724_PWRKEY: 01_MCU (U6.176), 04_AIR724_PERIPHERAL (R34.2)
STM32_AIR724_RESET: 01_MCU (U6.175), 04_AIR724_PERIPHERAL (R35.2)
STM32_UART1_CTS: 01_MCU (U6.122), 04_AIR724_PERIPHERAL (U14.12)
STM32_UART1_RTS: 01_MCU (U6.123), 04_AIR724_PERIPHERAL (U14.13)
STM32_UART1_RXD: 01_MCU (U6.121), 04_AIR724_PERIPHERAL (U14.11)
STM32_UART1_TXD: 01_MCU (U6.120), 04_AIR724_PERIPHERAL (U14.10)